# Altium schematic sheet overall.SchDoc
size A4; SheetNumber: 1; SheetTotal: 1
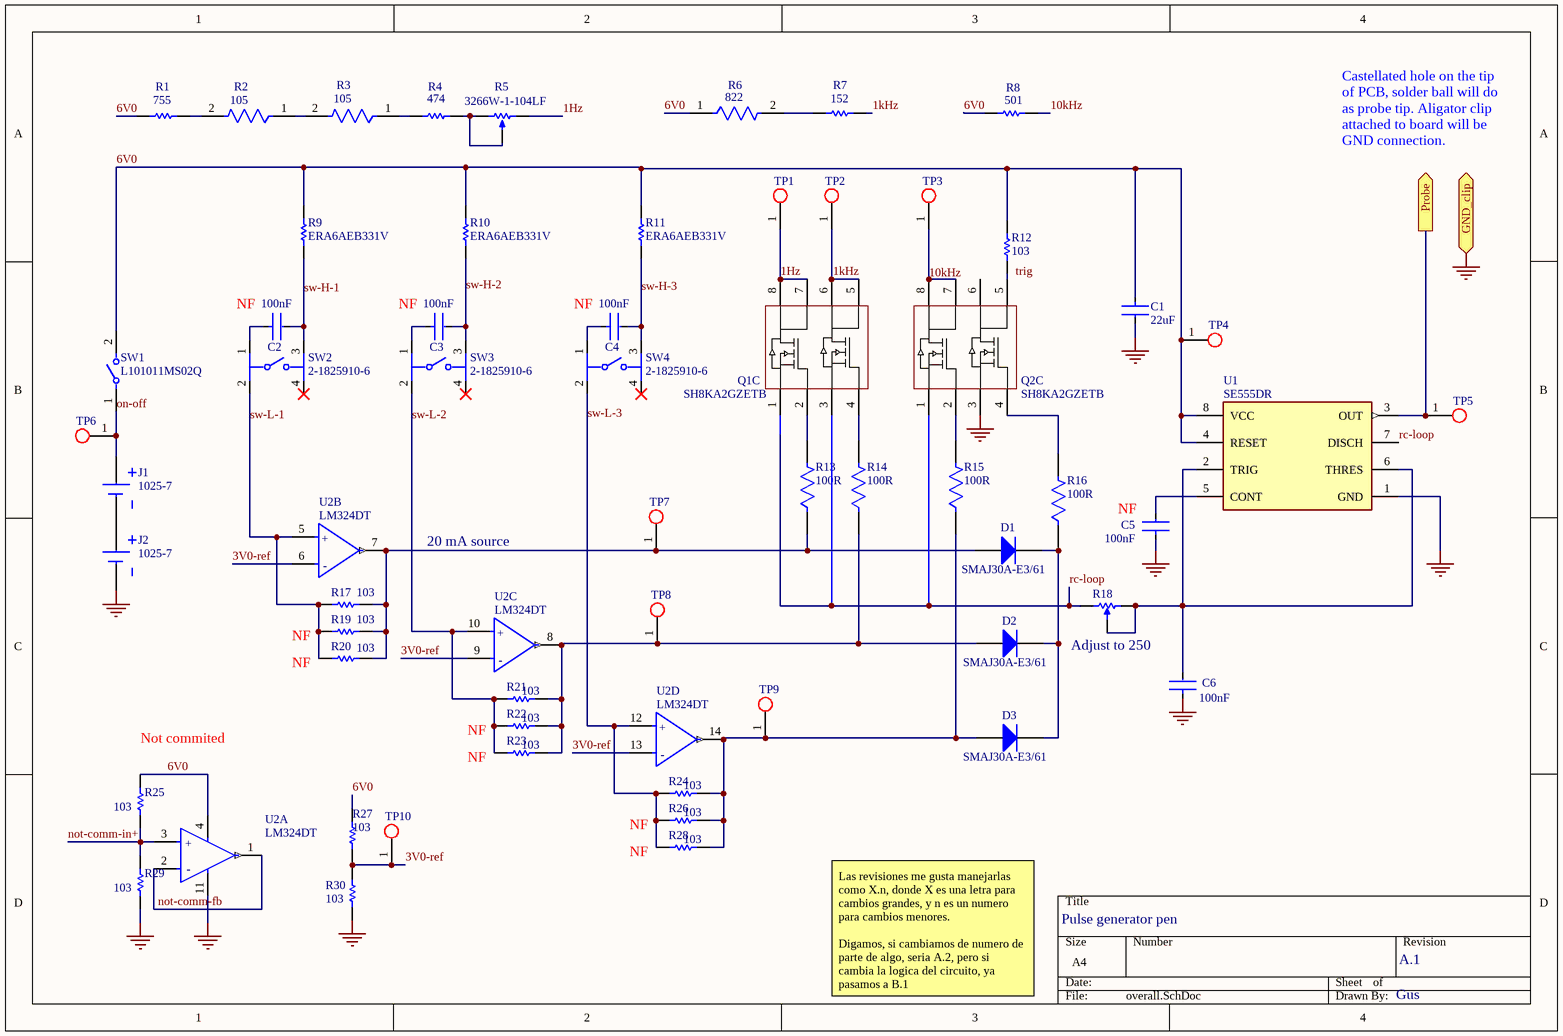
[diagram p0: overall.SchDoc]

## Parts
C1  Capacitance: 22uF  [FP-C2012-125-0_2-IPC_A]  (hidden comment: C2012X5R1V226M125AC)
C2  Capacitance: 100nF  [FP-CL21-IPC_A]  (hidden comment: CL21B104KBCNNNC)
C3  Capacitance: 100nF  [FP-CL21-IPC_A]  (hidden comment: CL21B104KBCNNNC)
C4  Capacitance: 100nF  [FP-CL21-IPC_A]  (hidden comment: CL21B104KBCNNNC)
C5  Capacitance: 100nF  [FP-CL21-IPC_A]  (hidden comment: CL21B104KBCNNNC)
C6  Capacitance: 100nF  [FP-CL21-IPC_A]  (hidden comment: CL21B104KBCNNNC)
D1  SMAJ30A-E3/61  [VISH-DO-214AC-2_N]
D2  SMAJ30A-E3/61  [VISH-DO-214AC-2_N]
D3  SMAJ30A-E3/61  [VISH-DO-214AC-2_N]
J1  1025-7  [KEYSTONE-1025-7-2_V]
J2  1025-7  [KEYSTONE-1025-7-2_V]
Q1  SH8KA2GZETB  [SOIC127P600X175-8N]  (part C of 4)
Q2  SH8KA2GZETB  [SOIC127P600X175-8N]  (part C of 4)
R1  Resistance: 755  [RESC2013X50X30LL20T20]  (hidden comment: CRCW08057M50JNEA)
R2  Resistance: 105  [FP-ERJ6EN-IPC_A]  (hidden comment: ERJ-6ENF1004V)
R3  Resistance: 105  [FP-ERJ6EN-IPC_A]  (hidden comment: ERJ-6ENF1004V)
R4  Resistance: 474  [RESC2013X70X40ML20T20]  (hidden comment: ERJ6ENF4703V)
R5  3266W-1-104LF  [BOUR-3266W-3_V]
R6  Resistance: 822  [FP-RC2012-IPC_A]  (hidden comment: RC2012J822CS)
R7  Resistance: 152  [RESC2013X60X35LL10T20]  (hidden comment: RC0805FR-071K5L)
R8  Resistance: 501  [RESC2013X58X38LL25T25]  (hidden comment: WSLP0805R0500FEA)
R9  ERA6AEB331V  [RESC2013X60X40LL20T25]
R10  ERA6AEB331V  [RESC2013X60X40LL20T25]
R11  ERA6AEB331V  [RESC2013X60X40LL20T25]
R12  Resistance: 103  [RESC2013X60X35NL10T20]  (hidden comment: RC0805FR-0710KL)
R13  Resistance: 100R  [FP-CRCW0805-HPe3-IPC_A]  (hidden comment: CRCW0805100RFKEAHP)
R14  Resistance: 100R  [FP-CRCW0805-HPe3-IPC_A]  (hidden comment: CRCW0805100RFKEAHP)
R15  Resistance: 100R  [FP-CRCW0805-HPe3-IPC_A]  (hidden comment: CRCW0805100RFKEAHP)
R16  Resistance: 100R  [FP-CRCW0805-HPe3-IPC_A]  (hidden comment: CRCW0805100RFKEAHP)
R17  Resistance: 103  [RESC2013X60X35NL10T20]  (hidden comment: RC0805FR-0710KL)
R18  3296W-1-102LF  [BOUR-3296W-1-3]  (value not drawn)
R19  Resistance: 103  [RESC2013X60X35NL10T20]  (hidden comment: RC0805FR-0710KL)
R20  Resistance: 103  [RESC2013X60X35NL10T20]  (hidden comment: RC0805FR-0710KL)
R21  Resistance: 103  [RESC2013X60X35NL10T20]  (hidden comment: RC0805FR-0710KL)
R22  Resistance: 103  [RESC2013X60X35NL10T20]  (hidden comment: RC0805FR-0710KL)
R23  Resistance: 103  [RESC2013X60X35NL10T20]  (hidden comment: RC0805FR-0710KL)
R24  Resistance: 103  [RESC2013X60X35NL10T20]  (hidden comment: RC0805FR-0710KL)
R25  Resistance: 103  [RESC2013X60X35NL10T20]  (hidden comment: RC0805FR-0710KL)
R26  Resistance: 103  [RESC2013X60X35NL10T20]  (hidden comment: RC0805FR-0710KL)
R27  Resistance: 103  [RESC2013X60X35NL10T20]  (hidden comment: RC0805FR-0710KL)
R28  Resistance: 103  [RESC2013X60X35NL10T20]  (hidden comment: RC0805FR-0710KL)
R29  Resistance: 103  [RESC2013X60X35NL10T20]  (hidden comment: RC0805FR-0710KL)
R30  Resistance: 103  [RESC2013X60X35NL10T20]  (hidden comment: RC0805FR-0710KL)
SW1  L101011MS02Q  [FP-L101011MS02Q-MFG]
SW2  2-1825910-6  [FP-2-1825910-6-MFG]
SW3  2-1825910-6  [FP-2-1825910-6-MFG]
SW4  2-1825910-6  [FP-2-1825910-6-MFG]
TP1  TP_opening  [New footprint 1]  (value not drawn)
TP2  TP_opening  [New footprint 1]  (value not drawn)
TP3  TP_opening  [New footprint 1]  (value not drawn)
TP4  TP_opening  [New footprint 1]  (value not drawn)
TP5  TP_opening  [New footprint 1]  (value not drawn)
TP6  TP_opening  [New footprint 1]  (value not drawn)
TP7  TP_opening  [New footprint 1]  (value not drawn)
TP8  TP_opening  [New footprint 1]  (value not drawn)
TP9  TP_opening  [New footprint 1]  (value not drawn)
TP10  TP_opening  [New footprint 1]  (value not drawn)
U1  SE555DR  [FP-D0008A-MFG]
U2  LM324DT  [FP-SO-14-MFG]  (parts A,B,C,D of 4)

## Ports
GND_clip (bidir), Probe (out)

## Nets
GND: C1.2 C5.1 C6.1 J2.2(-) Q2.3 R29.1 R30.1 U1.1(GND) U2.11(VCC-) ; port GND_clip
1Hz: Q1.7 Q1.8 R5.3(CW) TP1.1
1kHz: Q1.5 Q1.6 R7.2 TP2.1
3V0-ref: R27.1 R30.2 TP10.1 U2.6(Inverting_Input_2) U2.9(Inverting_Input_3) U2.13(Inverting_Input_4)
6V0: C1.1 R1.2 R6.1 R8.1 R9.1 R10.1 R11.1 R12.1 R25.2 R27.2 SW1.2 TP4.1 U1.4(RESET) U1.8(VCC) U2.4(VCC+)
10kHz: Q2.7 Q2.8 R8.2 TP3.1
not-comm-fb: U2.1(Output_1) U2.2(Inverting_Input_1)
not-comm-in+: R25.1 R29.2 U2.3(Non-Inverting_Input_1)
on-off: J1.1(+) SW1.1 TP6.1
Probe: TP5.1 U1.3(OUT) ; port Probe
rc-loop: Q1.1 Q1.3 Q2.1 R18.1(A) U1.7(DISCH)
sw-H-1: C2.2 R9.2 SW2.3
sw-H-2: C3.2 R10.2 SW3.3
sw-H-3: C4.2 R11.2 SW4.3
sw-L-1: R17.2 R19.2 R20.2 SW2.2 U2.5(Non-Inverting_Input_2)
sw-L-2: R21.2 R22.2 R23.2 SW3.2 U2.10(Non-Inverting_Input_3)
sw-L-3: R24.2 R26.2 R28.2 SW4.2 U2.12(Non-Inverting_Input_4)
NetC2_1: C2.1 SW2.1
NetC3_1: C3.1 SW3.1
NetC4_1: C4.1 SW4.1
NetC5_2: C5.2 U1.5(CONT)
NetC6_2: C6.2 R18.2(B) R18.3(TAP) U1.2(TRIG) U1.6(THRES)
NetD1_1: D1.1(K) D2.1(K) D3.1(K) R16.1
NetD1_2: D1.2(A) R13.1 R17.1 R19.1 R20.1 TP7.1 U2.7(Output_2)
NetD2_2: D2.2(A) R14.1 R21.1 R22.1 R23.1 TP8.1 U2.8(Output_3)
NetD3_2: D3.2(A) R15.1 R24.1 R26.1 R28.1 TP9.1 U2.14(Output_4)
NetJ1_2: J1.2(-) J2.1(+)
NetQ1_2: Q1.2 R13.2
NetQ1_4: Q1.4 R14.2
NetQ2_2: Q2.2 R15.2
NetQ2_4: Q2.4 R16.2
NetQ2_5: Q2.5 R12.2
NetR1_1: R1.1 R2.2
NetR2_1: R2.1 R3.2
NetR3_1: R3.1 R4.1
NetR4_2: R4.2 R5.1(CCW) R5.2(WIPER)
NetR6_2: R6.2 R7.1

Not connected (* = marked no-connect by the designer): Q2 6; SW2 4*; SW3 4*; SW4 4*

## Notes on the sheet
- Castellated hole on the tip of PCB, solder ball will do as probe tip. Aligator clip attached to board will be GND connection.
- (near C2) NF
- (near C3) NF
- (near C4) NF
- (near C5) NF
- 20 mA source
- NF
- Adjust to 250
- (near R25) Not commited
- Pulse generator pen
- Las revisiones me gusta manejarlas como X.n, donde X es una letra para cambios grandes, y n es un numero para cambios menores.
  Digamos, si cambiamos de numero de parte de algo, seria A.2, pero si cambia la logica del circuito, ya pasamos a B.1
- A.1
- Gus
- Labels drawn without touching a wire or pin: trig
- (in symbol CMP-12131-000005-1, part A) +; -
- (in symbol CMP-12131-000005-1, part B) +; -
- (in symbol CMP-12131-000005-1, part C) +; -
- (in symbol CMP-12131-000005-1, part D) +; -

## Library data of the parts
C1 = CMP-2000-06038-3: Multilayer Ceramic Capacitors 22μF ±20% 35V X5R SMD 0805; Tolerance: 20%; RoHS Compliant: Yes; Height: 1.25mm; Termination: SMD/SMT; Case/Package: 0805; Thickness: 0.057inch; Max Operating Temperature: 85°C; Min Operating Temperature: -55°C; Voltage Rating (DC): 35V; Length: 0.079inch; Dielectric: X5R; Dielectric Material: Ceramic; Voltage Rating: 35V; Mount: Surface Mount; Package Quantity: 2000; Lead Free: Lead Free; Weight: 0.000194oz; REACH SVHC: No SVHC; Width: 0.049inch; Packaging: Tape and Reel; Series: C; Case Code (Metric): 2012; Case Code (Imperial): 0805
C2-C6 = CMP-2000-05017-2: CL21 Series 0805 100nF 50V ±10% Tolerance X7R Multilayer Ceramic Chip Capacitor; Depth: 1.25mm; Height: 0.85mm; Width: 0.049inch; Tolerance: 10%; Case Code (Metric): 2012; Case Code (Imperial): 0805; Material: Ceramic; Thickness: 0.037inch; Min Operating Temperature: -55°C; Contact Plating: Tin; Length: 2mm; Mount: Surface Mount; Voltage Rating (DC): 50V; Lead Free: Lead Free; Dielectric: X7R; Radiation Hardening: No; Voltage Rating: 50V; Case/Package: 0805; Packaging: Tape and Reel; Max Operating Temperature: 125°C; Voltage: 50V
D1-D3 = CMP-0548-00228-2: Transient Voltage Suppressor, 6.40 to 231 V, 30 V Stand-off Voltage, Uni-Directional, -55 to 155 degC, 2-pin DO-214AC, Pb-Free, Tape and Reel; Manufacturer: Vishay Semiconductor; ID (uA): 1; VWM (V): 30; IFSM: 40 A; PPPM (W): 400, 300; VBR Uni-Directional (V): 6.4 to 231; Mounting Technology: Surface Mount; Packing: Tape and Reel; ComponentLink1URL: http://www.vishay.com/; ComponentLink3URL: http://www.vishay.com/docs/88390/smaj50a.pdf; DatasheetVersion: 12/8/2013; RoHS: TRUE; PartNumber: SMAJ30A-E3/61; PackageReference: DO-214AC-2; ComponentLink2URL: http://www.vishay.com/docs/88390/smaj50a.pdf; ComponentLink1Description: Manufacturer URL; Operating Junction and Storage Temperature Range: -55 to 150 degC; PackageDescription: 2-Pin DO-214AC (SMA), Body 4.245 x 2.665 mm; ComponentLink3Description: Package Specification; ComponentLink2Description: Datasheet
J1 J2 = CMP-0465-00001-2: Holder for 2477 or 2430 Cells P/N 1025-7, Body 27.762 x 30.963 mm, THM; Manufacturer: Keystone; # of Cells: 1; Cell Size: 24 mm; ComponentLink1Description: Manufacturer URL; PackageDescription: 2-Pin Hand Drawn, Body 27.762 x 30.963 mm; Material: Plastic; ComponentLink1URL: http://www.keyelco.com/; Type: HOLDER; ComponentLink2URL: http://www.keyelco.com/product-pdf.cfm?p=3950; Switch Current Limit (Typ) (A): 1; PartNumber: 1025-7; ComponentLink2Description: Datasheet; PackageReference: KEYSTONE-1025-7-2; DatasheetVersion: Rev.C; Mounting Technology: Through Hole
Q1 Q2 = CMP-013-00035-1: Power Field-Effect Transistor, 30V, 0.028ohm, 2-Element, N-Channel, Silicon, Metal-oxide Semiconductor FET; Avalanche Energy Rating (Eas): 2.6mJ; Drain-source On Resistance-Max: 28mR; FET Technology: METAL-OXIDE SEMICONDUCTOR; RoHS Compliant: Yes; Pins: 8; DS Breakdown Voltage-Min: 30V
R1 = CMP-2001-04122-1: Manufacturer: Vishay Dale; Part Number: CRCW08057M50JNEA
R2 R3 = CMP-2001-04378-6: RES SMD 1M OHM 1% 1/8W 0805; Temperature Coefficient: 100ppm/°C; Power Rating: 125mW; Voltage Rating: 150V; Length: 2mm; Height: 0.6mm; Technology: THICK FILM; Max Operating Temperature: 155°C; Case Code (Metric): 2012; Number of Terminations: 2; Radiation Hardening: No; Package Quantity: 1; Case Code (Imperial): 0805; Tolerance: 1%; RoHS Compliant: Yes; Contact Plating: Tin; Case/Package: 0805; Max Power Dissipation: 125mW; REACH SVHC: No SVHC; Lead Free: Lead Free; Termination: SMD/SMT; Size Code: 0805; Resistance Tolerance: 1%; Construction: Rectangular; Series: ERJ; Resistor Type: Thick Film; Depth: 1.25mm; Packaging: Tape and Reel; Min Operating Temperature: -55°C; Mount: Surface Mount; Features: Automotive AEC-Q200; Voltage Rating (DC): 150V; Military Standard: Not; Width: 1.2mm; Number of Pins: 2
R4 = CMP-2001-00552-1: Manufacturer: Panasonic; Part Number: ERJ6ENF4703V
R5 = CMP-0975-00021-1: Square Trimpot Trimming Potentiometer, 100 KOhm, 0.25 W, -55 to 125 degC, 3-Pin THD, RoHS, Tube; Manufacturer: Bourns; Power Rating@70 degC: 0.25 W; Tolerance: +/-10%; ComponentLink2URL: https://www.bourns.com/data/global/pdfs/3266.pdf; ComponentLink3Description: Package Specification; ComponentLink1URL: https://www.bourns.com/; ComponentLink2Description: Datasheet; DatasheetVersion: Apr-14; ComponentLink3URL: https://www.bourns.com/data/global/pdfs/3266.pdf; Mounting Technology: Through Hole; Packing: Tube; PackageDescription: 3-Pin THD, Body 6.35 x 4.31 mm, Pitch 2.54 mm; ComponentLink1Description: Manufacturer URL; Operating Temperature: -55 to 125 degC; PartNumber: 3266W-1-104LF; Resistance: 100 kOhm; RoHS: TRUE
R6 = CMP-13261-006466-1: Res Thick Film 0805 8.2kΩ 5% 0.125W ±100ppm/°C Molded SMD T/R; Voltage Rating (DC): 150V; Max Power Dissipation: 125mW; Resistor Type: Thick Film; Height: 0.024inch; Number of Terminations: 2; Length: 0.079inch; Series: RC; Case/Package: 0805; Military Standard: Not; Temperature Coefficient: 100ppm/°C; Case Code (Imperial): 0805; Tolerance: 5%; Lead Free: Lead Free; Construction: Rectangular; Case Code (Metric): 2012; Depth: 1.25mm; Packaging: Tape and Reel; Radiation Hardening: No; RoHS Compliant: Yes; Width: 0.049inch; Min Operating Temperature: -55°C; Contact Plating: Tin; Max Operating Temperature: 155°C; Features: Moisture Resistant
R7 = CMP-1659-00010-2: RES 1.50K OHM 1/8W 1% 0805 SMD; Manufacturer: Yageo; PackageReference: 0805; ComponentLink1URL: http://www.yageo.com/documents/recent/PYu-RC_Group_51_RoHS_L_04.pdf; ComponentLink1Description: Datasheet; PartNumber: RC0805FR-071K5L
R8 = CMP-2001-04326-1: Manufacturer: Vishay Dale; Part Number: WSLP0805R0500FEA
R9-R11 = CMP-2001-00628-1: Manufacturer: Panasonic; Part Number: ERA6AEB331V
R12 R17 R19-R30 = CMP-1659-00013-4: Chip Resistor, 10 KOhm, +/- 1%, 0.125 W, -55 to 155 degC, 0805 (2012 Metric), RoHS, Tape and Reel; Manufacturer: Yageo; Voltage Rating: 150 V; Mount: Surface Mount; ComponentLink1Description: Manufacturer URL; ComponentLink2URL: http://www.yageo.com/documents/recent/PYu-RC_Group_51_RoHS_L_04.pdf; Pins: 2; Length: 2 mm; Min Operating Temperature: -55 degC; Height: 0.5 mm; Mounting Technology: Surface Mount; RoHSCompliant: true; REACH SVHC: No SVHC; ComponentLink1URL: http://www.yageo.com/; Max Operating Temperature: 155 degC; PackageReference: 0805; DatasheetVersion: Rev. 4, 02/2016; Package Quantity: 5000; Packaging: Tape and Reel; ComponentLink2Description: Datasheet; PackageDescription: 2-Pin Surface Mounted Device, Body 2 x 1.25 mm
R13-R16 = CMP-02407-011702-1: RES Thick Film, 100Ω, 1%, 0.5W, 100ppm/°C, 0805; Power Rating: 330mW; Voltage Rating: 150V; Max Power Dissipation: 500mW; Case/Package: 0805; Radiation Hardening: No; Number of Terminations: 2; Features: Automotive AEC-Q200; RoHS Compliant: Yes; Height: 0.5mm; Technology: THICK FILM; Contact Plating: Tin; Series: CRCW-HP; Max Operating Temperature: 155°C; Tolerance: 1%; Package Quantity: 5000; Construction: Rectangular; Width: 1.2mm; Lead Free: Lead Free; Resistor Type: Thick Film; Resistance Tolerance: 1%; Length: 2mm; Weight: 0.000194oz; Termination: SMD/SMT; Depth: 1.25mm; Packaging: Tape and Reel; Voltage Rating (DC): 150V; Case Code (Imperial): 0805; Military Standard: Not; Case Code (Metric): 2012; Mount: Surface Mount; Min Operating Temperature: -55°C; Temperature Coefficient: 100ppm/°C
R18 = CMP-1747-00002-1: Square Trimpot(R) Trimming Potentiometer, 1000 Ohm, -55 to 125 degC, 3-Pin THD, RoHS, Tube; Case\Package: 0603; Tolerance: 1%; Power Rating: 100 mW; Voltage Rating: 75 V; Resistance: 4.7 kohm; ComponentLink2URL: http://www.bourns.com/docs/Product-Datasheets/3296.pdf; Packaging: Tape and Reel; REACH SVHC: Yes; ComponentLink1URL: http://www.bourns.com/; Case Code (Metric): 1608; Width: 0.8 mm; ComponentLink1Description: Manufacturer URL; DatasheetVersion: May-16; Max Operating Temperature: 155 degC; PackageReference: 3296W-1-3; PackageDescription: 3-Pin Through Hole Device, Body 9.53 x 4.83 mm, Pitch 2.54 mm; Weight: 7.1E-05 oz; ComponentLink2Description: Datasheet; RoHSCompliant: true; Min Operating Temperature: -55 degC; Radiation Hardening: No; Case Code (Imperial): 0603; Length: 1.6 mm; Package Quantity: 5000; Pins: 2; Mount: Surface Mount; Height: 0.45 mm
SW1 = CMP-10038-000020-1: SWITCH SLIDE SPST 4A 125V; Actuator Length: 5.08mm; Actuator Type: Standard; Contact Current Rating: 2A; Electrical Life: 10000Cycles; Switch Function: On-Off; Voltage Rating (DC): 28V; Actuator Color: Black; Actuator Material: Nylon; Switch Travel: 3.81mm; Max Voltage Rating (AC): 250V; Max Current Rating: 4A; Contact Plating: Silver; Throw Configuration: SPST; Depth: 10.8mm; Package Quantity: 1; Length: 19.1mm; Current Rating: 4A; Max Operating Temperature: 65°C; Orientation: Straight; Radiation Hardening: No; Termination: PC Pins; Max Voltage Rating (DC): 125V; Series: L; Min Operating Temperature: -30°C; Contact Material: Copper; Lead Free: Lead Free; Mount: Through Hole; RoHS Compliant: Yes; Voltage Rating (AC): 125V; Packaging: Bulk; Housing Material: Nylon
SW2-SW4 = CMP-03407-000025-1: SWITCH TACTILE SPST-NO 0.05A 24V; Max Current Rating: 50mA; Actuator Type: Standard; Illumination Type: Non-Illuminated; Actuator Material: Nylon; Throw Configuration: SPST; Actuator Length: 0.37inch; Operating Force: 100gf; Switch Function: Off-Mom; Mechanical Life: 100000Cycles; Actuator Color: Brown; Switch Travel: 0.25mm; Packaging: Loose Piece; Series: FSMJ; RoHS Compliant: Yes; Mount: Through Hole; Lead Free: Lead Free; Length: 5.99mm; Voltage Rating (DC): 24V; Type: Switch; Contact Current Rating: 50mA; Contact Material: Copper Alloy; Max Operating Temperature: 85°C; Min Operating Temperature: -35°C; Termination: PC Pin; ELV: Compliant; Orientation: Straight; Contact Plating: Silver
TP1-TP10 = CMP-00030-00001-3: Soldermask opening or top layer pad for testing purposes
U1 = CMP-04858-000018-1: IC OSC SGL TIMER 100KHZ 8-SOIC; Nominal Supply Current: 4mA; Min Supply Voltage: 4.5V; Max Supply Voltage: 18V; High Level Output Current: -200mA; Quiescent Current: 12mA; Operating Supply Current: 10mA; Number of Timers/Counters: 1; Low Level Output Current: 200mA; Weight: 0.002677oz; Frequency: 100kHz; Lead Free: Lead Free; Supply Current: 4mA; RoHS Compliant: Yes; Package Quantity: 2500; Min Operating Temperature: -55°C; Series: -; Radiation Hardening: No; Contact Plating: Gold; Packaging: Tape and Reel; Case/Package: SOIC; Number of Pins: 8; Mount: Surface Mount; Max Operating Temperature: 125°C; REACH SVHC: No SVHC
U2 = CMP-12131-000005-1: IC OPAMP GP 4 CIRCUIT 14SO; Manufacturer: STMicroelectronics; Voltage Gain: 100dB; Standoff Height: 0.1mm; Bandwidth: 1.3MHz; Max Junction Temp: +150°C; Min Supply Voltage: 3V; Max Dual Supply Voltage: 15V; Min Dual Supply Voltage: 1.5V; Number Of Channels: 4; Nominal Supply Current: 0.7-1.5mA; Output Current Per Channel: 20-50mA; Max Supply Voltage: 30V; Input Offset Voltage: 2mV; Input Bias Current: 0.02uA; Device Class L1: Integrated Circuits (ICs); Device Class L3: Amplifiers - Op Amps; Temperature Range Low: 0°C; Package: SO-14; Temperature Range High: +70°C; Digikey Description: IC OPAMP GP 4 CIRCUIT 14SO; Device Class L2: Linear ICs; Footprint Url: https://www.st.com/content/ccc/resource/technical/document/datasheet/group3/10/8a/e6/12/f8/e8/49/ce/DM00366438/files/DM00366438.pdf/jcr:content/translations/en.DM00366438.pdf; Octopart: https://octopart.com/lm324dt-stmicroelectronics-39579146; ComponentLink2URL: https://www.st.com/content/ccc/resource/technical/document/datasheet/bd/fc/46/43/26/8f/40/7f/CD00001046.pdf/files/CD00001046.pdf/jcr:content/translations/en.CD00001046.pdf; ComponentLink2Description: Datasheet; Lead Free: Yes; Temperature: 0°C to +70°C; RoHS: TRUE; Gain Bandwidth: 1.3MHz; Manufacturer Part Number: LM324DT; Automotive: No; Category: IC; Height: 1.75mm; Mouser Description: LM324 Series 32 V 1.3 MHz Low Power Quad Operational Amplifier - SOIC-14